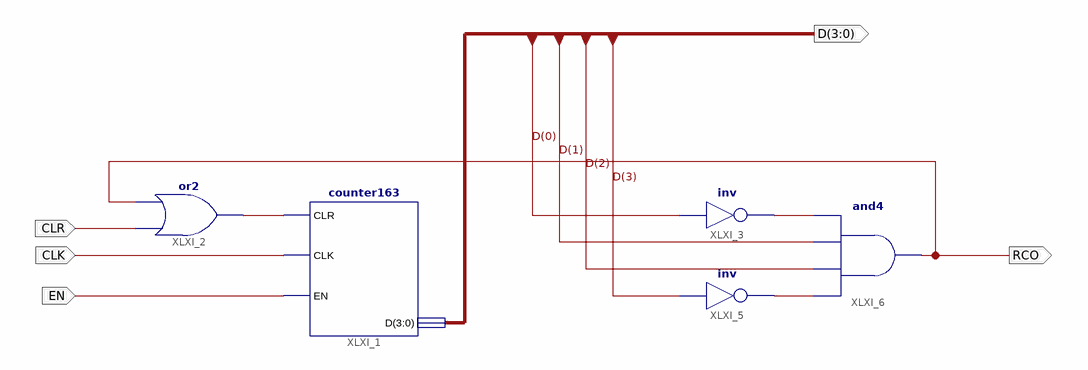
[diagram p0: schematic sheet 1]
// Xilinx ISE schematic mod6.sch (spartan3e) as structural Verilog: 5 symbols, 5 ports
module mod6 (
  input  CLK,
  input  CLR,
  input  EN,
  output RCO,
  output [3:0] D
);

  wire XLXN_1, XLXN_9, XLXN_10;

  counter163 XLXI_1 (.CLR(XLXN_1), .CLK(CLK), .EN(EN), .D(D));
  or XLXI_2 (XLXN_1, CLR, RCO);
  not XLXI_3 (XLXN_9, D[0]);
  not XLXI_5 (XLXN_10, D[3]);
  and XLXI_6 (RCO, XLXN_10, D[2], D[1], XLXN_9);
endmodule
